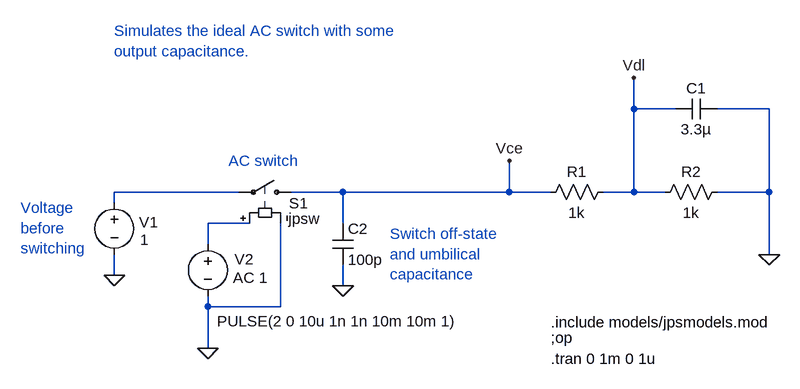
[diagram p0: schematic ideal_acswitch.asc]
ideal_acswitch.asc, the LTspice schematic file:
Version 4
SHEET 1 880 680
WIRE 336 -32 336 -80
WIRE 400 -32 336 -32
WIRE 544 -32 464 -32
WIRE -272 96 -464 96
WIRE -112 96 -192 96
WIRE 144 96 144 48
WIRE 144 96 -112 96
WIRE 208 96 144 96
WIRE 336 96 336 -32
WIRE 336 96 288 96
WIRE 384 96 336 96
WIRE 544 96 544 -32
WIRE 544 96 464 96
WIRE -464 112 -464 96
WIRE -256 144 -320 144
WIRE -112 144 -112 96
WIRE -320 176 -320 144
WIRE 544 192 544 96
WIRE -464 224 -464 192
WIRE -112 240 -112 208
WIRE -320 272 -320 256
WIRE -208 272 -208 144
WIRE -208 272 -320 272
WIRE -320 336 -320 272
FLAG -320 336 0
FLAG -464 224 0
FLAG 544 192 0
FLAG -112 240 0
FLAG 144 48 Vce
FLAG 336 -80 Vdl
SYMBOL sw -176 96 M270
WINDOW 0 -17 19 VLeft 2
WINDOW 3 -41 20 VLeft 2
SYMATTR InstName S1
SYMATTR Value jpsw
SYMBOL voltage -320 160 R0
WINDOW 123 39 68 Left 2
WINDOW 39 0 0 Left 2
WINDOW 0 41 39 Left 2
WINDOW 3 14 135 Left 2
SYMATTR Value2 AC 1
SYMATTR InstName V2
SYMATTR Value PULSE(2 0 10u 1n 1n 10m 10m 1)
SYMBOL voltage -464 96 R0
WINDOW 123 0 0 Left 2
WINDOW 39 0 0 Left 2
WINDOW 0 38 46 Left 2
WINDOW 3 40 73 Left 2
SYMATTR InstName V1
SYMATTR Value 1
SYMBOL res 192 112 R270
WINDOW 0 32 56 VTop 2
WINDOW 3 0 56 VBottom 2
SYMATTR InstName R1
SYMATTR Value 1k
SYMBOL res 368 112 R270
WINDOW 0 32 56 VTop 2
WINDOW 3 0 56 VBottom 2
SYMATTR InstName R2
SYMATTR Value 1k
SYMBOL cap 400 -16 R270
WINDOW 0 32 32 VTop 2
WINDOW 3 0 32 VBottom 2
SYMATTR InstName C1
SYMATTR Value 3.3µ
SYMBOL cap -128 144 R0
SYMATTR InstName C2
SYMATTR Value 100p
TEXT 208 320 Left 2 !;op
TEXT 208 296 Left 2 !.include models/jpsmodels.mod
TEXT 208 352 Left 2 !.tran 0 1m 0 1u
TEXT -608 120 Left 2 ;Voltage\nbefore\nswitching
TEXT -288 48 Left 2 ;AC switch
TEXT -40 160 Left 2 ;Switch off-state\nand umbilical\ncapacitance
TEXT -464 -152 Left 2 ;Simulates the ideal AC switch with some\noutput capacitance.

The netlist it stands for:
* ideal_acswitch.asc
S1 Vce N001 N002 0 jpsw
V2 N002 0 PULSE(2 0 10u 1n 1n 10m 10m 1) AC 1
V1 N001 0 1
R1 Vce Vdl 1k
R2 Vdl 0 1k
C1 Vdl 0 3.3µ
C2 Vce 0 100p
;op
.include models/jpsmodels.mod
.tran 0 1m 0 1u
* Voltage
* before
* switching
* AC switch
* Switch off-state
* and umbilical
* capacitance
* Simulates the ideal AC switch with some
* output capacitance.
.backanno
.end